# EAGLE design LightMeter (EAGLE 5.11)
PN: PRT-09545
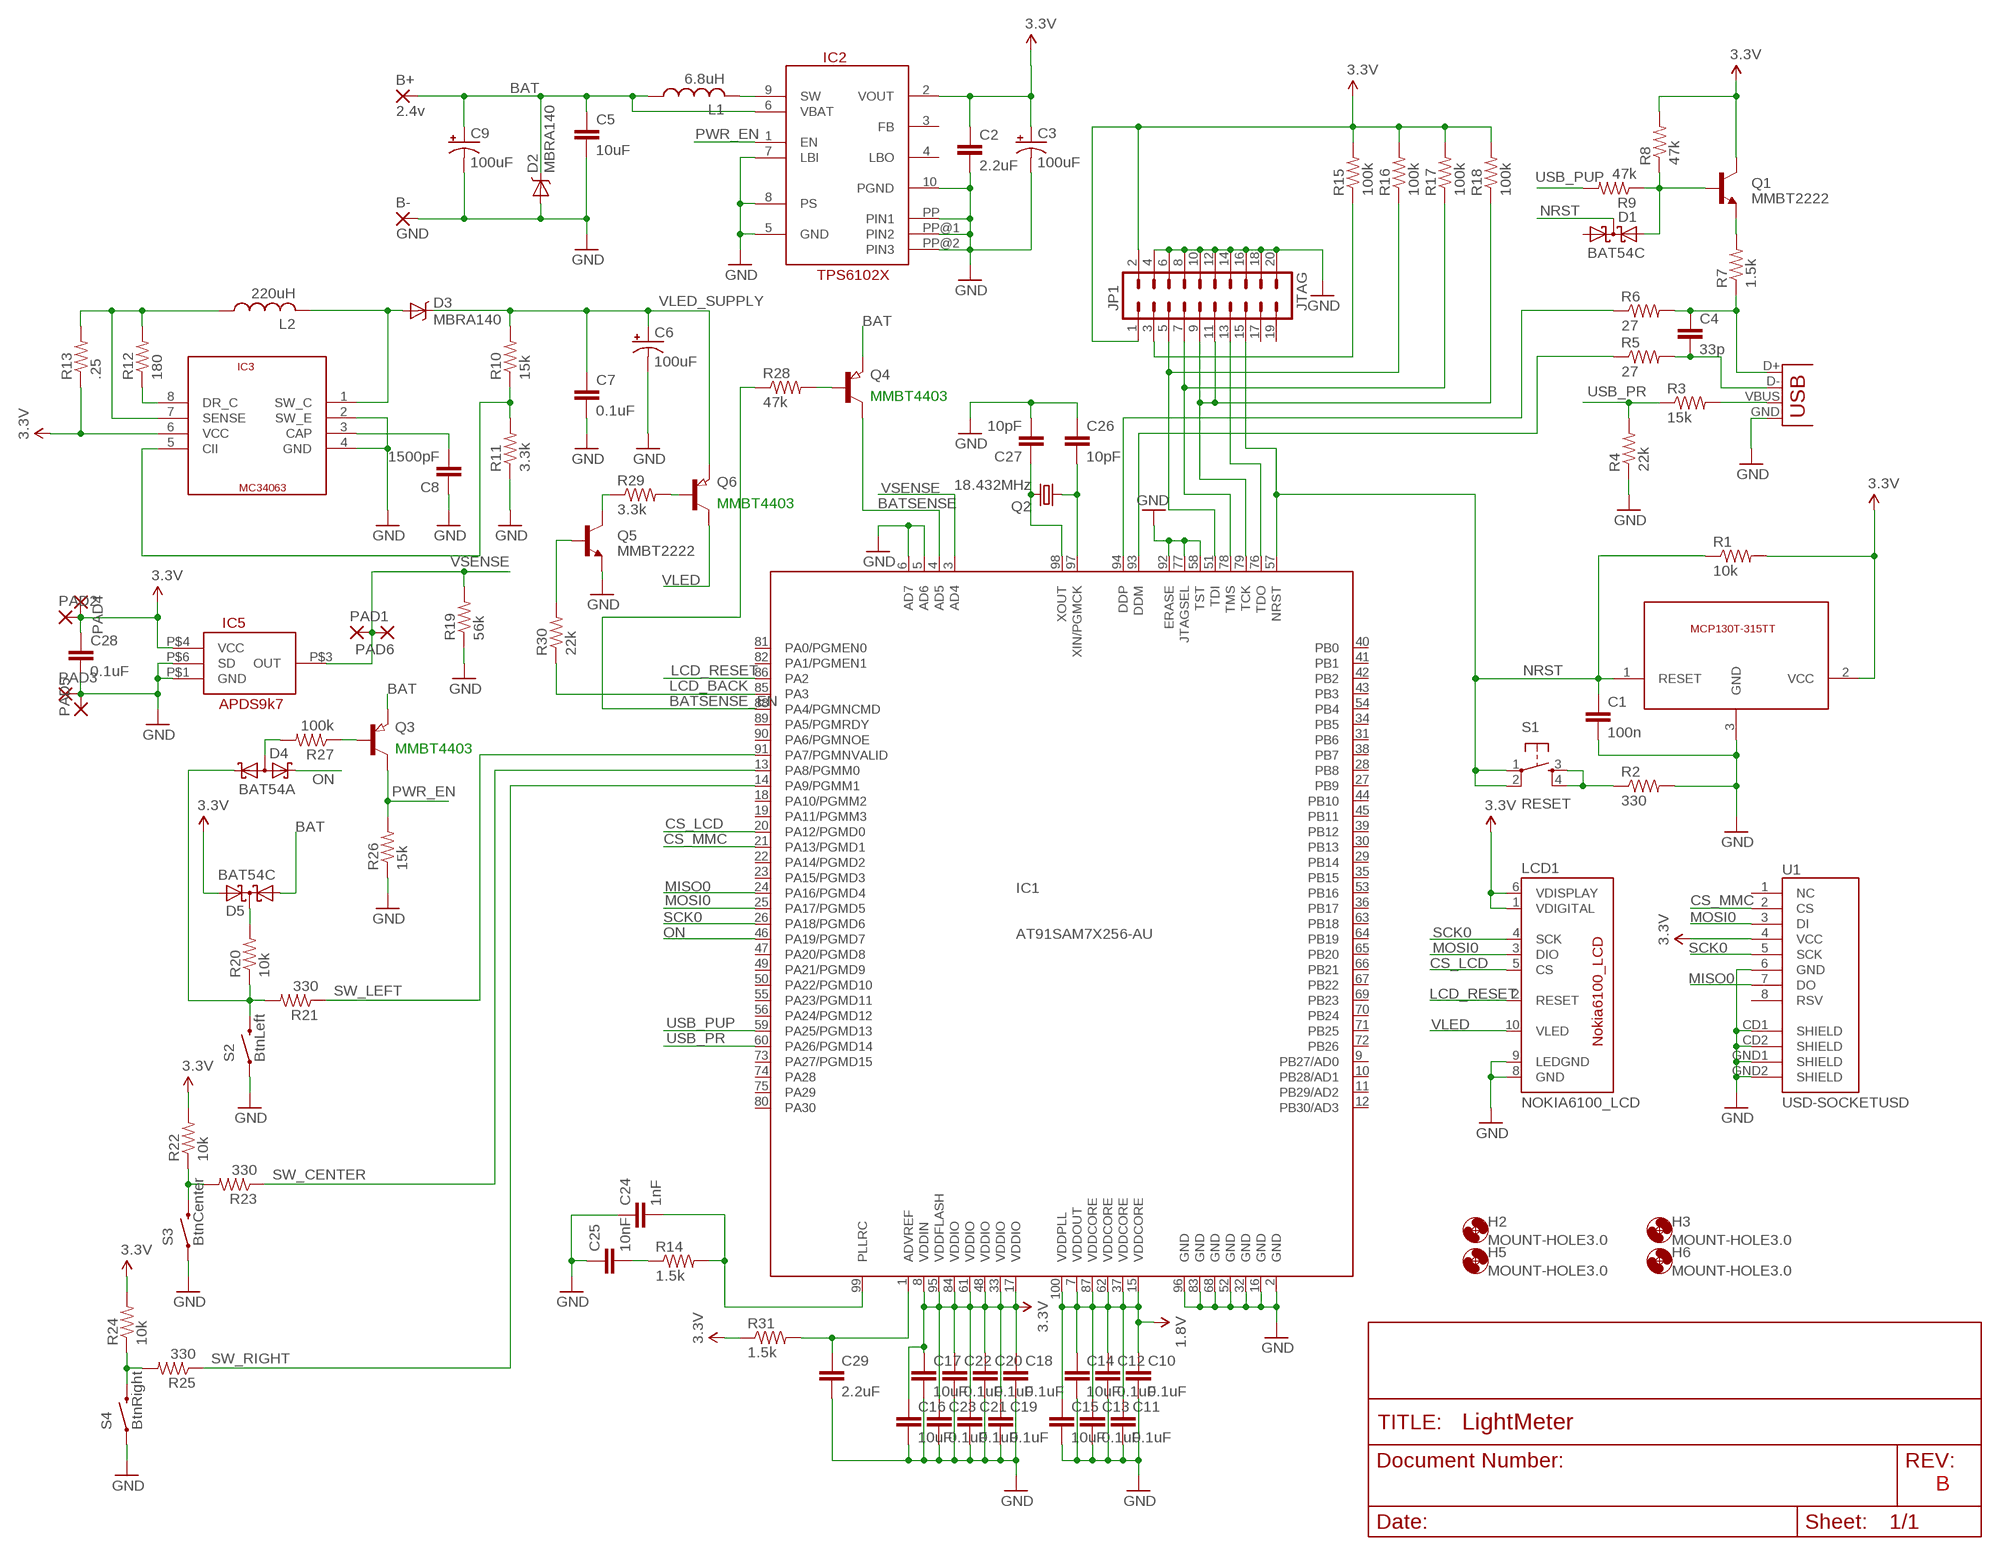
[diagram p0: schematic, sheet 1]

## Parts
B+  2.4v  2,54/1,0  [2,54/1,0]
B-  GND  2,54/1,0  [2,54/1,0]
C1  100n  CAP0805  [0805]
C2  2.2uF  CAP0805  [0805]
C3  100uF  CAP_POL7343  [EIA7343]
C4  33p  CAP0805  [0805]
C5  10uF  CAP0805  [0805]
C6  100uF  CAP_POL7343  [EIA7343]
C7  0.1uF  CAP0805  [0805]
C8  1500pF  CAP0805  [0805]
C9  100uF  CAP_POL7343  [EIA7343]
C10  0.1uF  CAP0805  [0805]
C11  0.1uF  CAP0805  [0805]
C12  0.1uF  CAP0805  [0805]
C13  0.1uF  CAP0805  [0805]
C14  10uF  CAP0805  [0805]
C15  10uF  CAP0805  [0805]
C16  10uF  CAP0805  [0805]
C17  10uF  CAP0805  [0805]
C18  0.1uF  CAP0805  [0805]
C19  0.1uF  CAP0805  [0805]
C20  0.1uF  CAP0805  [0805]
C21  0.1uF  CAP0805  [0805]
C22  0.1uF  CAP0805  [0805]
C23  0.1uF  CAP0805  [0805]
C24  1nF  CAP0805  [0805]
C25  10nF  CAP0805  [0805]
C26  10pF  CAP0805  [0805]
C27  10pF  CAP0805  [0805]
C28  0.1uF  CAP0805  [0805]
C29  2.2uF  CAP0805  [0805]
D1  BAT54C  [SOT23]
D2  MBRA140  DIODE-SCHOTTKY_  [SMA-DIODE]
D3  MBRA140  DIODE-SCHOTTKY_  [SMA-DIODE]
D4  BAT54A  [SOT23]
D5  BAT54C  [SOT23]
H2  MOUNT-HOLE3.0  [3,0]
H3  MOUNT-HOLE3.0  [3,0]
H5  MOUNT-HOLE3.0  [3,0]
H6  MOUNT-HOLE3.0  [3,0]
IC1  AT91SAM7X256-AU  [LQFP100]
IC2  TPS6102X  [S-PDSO-N10]
IC3  MC34063  [SOIC8]
IC4  MCP130  MCP130SOT-23-3  [SOT23-3]
IC5  APDS9k7  APDS-9007  [APDS-9007]
JP1  JTAG  M010X2SHD  [2X10-SHROUDED]
L1  6.8uH  INDUCTORSL4949_MM  [L4949_MM]
L2  220uH  INDUCTORSL_SLF10145  [L_SLF10145]
LCD1  NOKIA6100_LCD  [NOKIA6100_LCD]
PAD1  WIREPAD1,6/0,9  [1,6/0,9]
PAD2  WIREPAD1,6/0,9  [1,6/0,9]
PAD3  WIREPAD1,6/0,9  [1,6/0,9]
PAD4  WIREPAD1,6/0,9  [1,6/0,9]
PAD5  WIREPAD1,6/0,9  [1,6/0,9]
PAD6  WIREPAD1,6/0,9  [1,6/0,9]
Q1  MMBT2222  TRANSISTOR_NPNSOT23-3  [SOT23-3]
Q2  18.432MHz  CRYSTALSMD  [HC49UP]
Q3  MMBT4403  PNP-TRANSISTOR_SOT23  [SOT23]
Q4  MMBT4403  PNP-TRANSISTOR_SOT23  [SOT23]
Q5  MMBT2222  TRANSISTOR_NPNSOT23-3  [SOT23-3]
Q6  MMBT4403  PNP-TRANSISTOR_SOT23  [SOT23]
R1  10k  RESISTOR  [0805]
R2  330  RESISTOR  [0805]
R3  15k  RESISTOR  [0805]
R4  22k  RESISTOR  [0805]
R5  27  RESISTOR  [0805]
R6  27  RESISTOR  [0805]
R7  1.5k  RESISTOR  [0805]
R8  47k  RESISTOR  [0805]
R9  47k  RESISTOR  [0805]
R10  15k  RESISTOR  [0805]
R11  3.3k  RESISTOR  [0805]
R12  180  RESISTOR  [0805]
R13  .25  RESISTOR  [0805]
R14  1.5k  RESISTOR  [0805]
R15  100k  RESISTOR  [0805]
R16  100k  RESISTOR  [0805]
R17  100k  RESISTOR  [0805]
R18  100k  RESISTOR  [0805]
R19  56k  RESISTOR  [0805]
R20  10k  RESISTOR  [0805]
R21  330  RESISTOR  [0805]
R22  10k  RESISTOR  [0805]
R23  330  RESISTOR  [0805]
R24  10k  RESISTOR  [0805]
R25  330  RESISTOR  [0805]
R26  15k  RESISTOR  [0805]
R27  100k  RESISTOR  [0805]
R28  47k  RESISTOR  [0805]
R29  3.3k  RESISTOR  [0805]
R30  22k  RESISTOR  [0805]
R31  1.5k  RESISTOR  [0805]
S1  RESET  TAC_SWITCHSMD  [TACTILE_SWITCH_SMD]
S2  BtnLeft  SWITCH-MOMENTARY-2PTH  [TACTILE-PTH]
S3  BtnCenter  SWITCH-MOMENTARY-2PTH  [TACTILE-PTH]
S4  BtnRight  SWITCH-MOMENTARY-2PTH  [TACTILE-PTH]
U1  USD-SOCKETUSD  [USD-SOCKET-PP]
X1  USBSMD  [USB-MINIB]

## Nets
1.8V [0.85 Amp]: C10.1 C11.1 C12.1 C13.1 C14.1 C15.1 IC1.7(VDDOUT) IC1.15(VDDCORE) IC1.37(VDDCORE) IC1.62(VDDCORE) IC1.87(VDDCORE) IC1.100(VDDPLL)
3.3V [0.85 Amp]: C2.1 C3.A(+) C16.1 C17.1 C18.1 C19.1 C20.1 C21.1 C22.1 C23.1 C28.1 D5.2(A2) IC1.8(VDDIN) IC1.17(VDDIO) IC1.33(VDDIO) IC1.48(VDDIO) IC1.61(VDDIO) IC1.84(VDDIO) IC1.95(VDDFLASH) IC2.2(VOUT) IC3.6(VCC) IC4.2(VCC) IC5.P$4(VCC) JP1.1 JP1.2 LCD1.1(VDIGITAL) LCD1.6(VDISPLAY) PAD2.1(P) PAD4.1(P) Q1.3(C) R1.2 R8.2 R13.1 R15.2 R16.2 R17.2 R18.2 R22.2 R24.2 R31.1 U1.4(VCC)
BAT [1.2 Amp]: B+.1(P) C5.1 C9.A(+) D2.C D5.1(A1) IC2.6(VBAT) L1.1 Q3.2(E) Q4.2(E)
BATSENSE: IC1.4(AD5) Q4.3(C)
BATSENSE_EN: IC1.88(PA4/PGMNCMD) R28.1
CS_LCD: IC1.20(PA12/PGMD0) LCD1.5(CS)
CS_MMC: IC1.21(PA13/PGMD1) U1.2(CS)
GND [0.85 Amp]: B-.1(P) C1.2 C2.2 C3.C(-) C5.2 C6.C(-) C7.2 C8.1 C9.C(-) C10.2 C11.2 C12.2 C13.2 C14.2 C15.2 C16.2 C17.2 C18.2 C19.2 C20.2 C21.2 C22.2 C23.2 C24.1 C25.1 C26.1 C27.2 C28.2 C29.2 D2.A IC1.2(GND) IC1.5(AD6) IC1.6(AD7) IC1.16(GND) IC1.32(GND) IC1.52(GND) IC1.58(TST) IC1.68(GND) IC1.77(JTAGSEL) IC1.83(GND) IC1.92(ERASE) IC1.96(GND) IC2.5(GND) IC2.7(LBI) IC2.8(PS) IC2.10(PGND) IC2.PP(PIN1) IC2.PP@1(PIN2) IC2.PP@2(PIN3) IC3.2(SW_E) IC3.4(GND) IC4.3(GND) IC5.P$1(GND) IC5.P$6(SD) JP1.4 JP1.6 JP1.8 JP1.10 JP1.12 JP1.14 JP1.16 JP1.18 JP1.20 LCD1.8(GND) LCD1.9(LEDGND) PAD3.1(P) PAD5.1(P) Q5.2(E) R2.2 R4.1 R11.1 R19.1 R26.1 S2.1 S3.1 S4.1 U1.6(GND) U1.CD1(SHIELD) U1.CD2(SHIELD) U1.GND1(SHIELD) U1.GND2(SHIELD) X1.GND
LCD_BACK: IC1.85(PA3) R30.1
LCD_RESET: IC1.86(PA2) LCD1.2(RESET)
MISO0: IC1.24(PA16/PGMD4) U1.7(DO)
MOSI0: IC1.25(PA17/PGMD5) LCD1.3(DIO) U1.3(DI)
N$1: R3.2 X1.VBUS
N$2: C4.2 R5.2 X1.D-
N$3: C4.1 R6.2 R7.1 X1.D+
N$4: R2.1 S1.3 S1.4
N$5: IC1.93(DDM) R5.1
N$6: IC1.94(DDP) R6.1
N$7: Q1.2(E) R7.2
N$8: D1.2(A2) Q1.1(B) R8.1 R9.1
N$9 [1.2 Amp]: IC2.9(SW) L1.2
N$11: D4.1(K1) R20.1 R21.2 S2.3
N$12: IC3.5(CII) R10.1 R11.2
N$13 [1.2 Amp]: D3.A IC3.1(SW_C) L2.2
N$14 [1.2 Amp]: IC3.8(DR_C) R12.1
N$15 [1.2 Amp]: IC3.7(SENSE) L2.1 R12.2 R13.2
N$16: C26.2 IC1.97(XIN/PGMCK) Q2.1
N$17: C27.1 IC1.98(XOUT) Q2.2
N$18: C25.2 R14.1
N$19: IC1.78(TMS) JP1.7 R17.1
N$20: IC1.76(TDO) JP1.13
N$21: IC1.79(TCK) JP1.9 JP1.11 R18.1
N$22: IC1.51(TDI) JP1.5 R16.1
N$23: JP1.3 R15.1
N$24: C8.2 IC3.3(CAP)
N$25: D5.3(CC) R20.2
N$26: Q3.1(B) R27.1
N$27: D4.3(AA) R27.2
N$28: R22.1 R23.2 S3.3
N$29: C24.2 IC1.99(PLLRC) R14.2
N$30: R24.1 R25.2 S4.3
N$34: C29.1 IC1.1(ADVREF) R31.2
N$35: Q4.1(B) R28.2
N$36: Q6.1(B) R29.2
N$37: Q5.3(C) R29.1
N$38: Q5.1(B) R30.2
NRST: C1.1 D1.3(CC) IC1.57(NRST) IC4.1(RESET) JP1.15 R1.1 S1.1 S1.2
ON: D4.2(K2) IC1.46(PA19/PGMD7)
PWR_EN: IC2.1(EN) Q3.3(C) R26.2
SCK0: IC1.26(PA18/PGMD6) LCD1.4(SCK) U1.5(SCK)
SW_CENTER: IC1.13(PA8/PGMM0) R23.1
SW_LEFT: IC1.91(PA7/PGMNVALID) R21.1
SW_RIGHT: IC1.14(PA9/PGMM1) R25.1
USB_PR: IC1.60(PA26/PGMD14) R3.1 R4.2
USB_PUP: IC1.59(PA25/PGMD13) R9.2
VLED [1.2 Amp]: LCD1.10(VLED) Q6.3(C)
VLED_SUPPLY [1.2 Amp]: C6.A(+) C7.1 D3.C Q6.2(E) R10.2
VSENSE: IC1.3(AD4) IC5.P$3(OUT) PAD1.1(P) PAD6.1(P) R19.2
Unconnected: D1.1(A1) IC1.9(PB27/AD0) IC1.10(PB28/AD1) IC1.11(PB29/AD2) IC1.12(PB30/AD3) IC1.18(PA10/PGMM2) IC1.19(PA11/PGMM3) IC1.22(PA14/PGMD2) IC1.23(PA15/PGMD3) IC1.27(PB9) IC1.28(PB8) IC1.29(PB14) IC1.30(PB13) IC1.31(PB6) IC1.34(PB5) IC1.35(PB15) IC1.36(PB17) IC1.38(PB7) IC1.39(PB12) IC1.40(PB0) IC1.41(PB1) IC1.42(PB2) IC1.43(PB3) IC1.44(PB10) IC1.45(PB11) IC1.47(PA20/PGMD8) IC1.49(PA21/PGMD9) IC1.50(PA22/PGMD10) IC1.53(PB16) IC1.54(PB4) IC1.55(PA23/PGMD11) IC1.56(PA24/PGMD12) IC1.63(PB18) IC1.64(PB19) IC1.65(PB20) IC1.66(PB21) IC1.67(PB22) IC1.69(PB23) IC1.70(PB24) IC1.71(PB25) IC1.72(PB26) IC1.73(PA27/PGMD15) IC1.74(PA28) IC1.75(PA29) IC1.80(PA30) IC1.81(PA0/PGMEN0) IC1.82(PA1/PGMEN1) IC1.89(PA5/PGMRDY) IC1.90(PA6/PGMNOE) IC2.3(FB) IC2.4(LBO) JP1.17 JP1.19 U1.1(NC) U1.8(RSV)

## Notes on the sheet
- B

## Library data of the parts
B+ B- = wirepad:2,54/1,0: THROUGH-HOLE PAD
C1 C2 C4 C5 C7 C8 C10-C29 = SparkFun:CAP: Capacitor Standard 0603 ceramic capacitor, and 0.1" leaded capacitor.
C3 C6 C9 = SparkFun:CAP_POL: Capacitor Polarized These are standard SMD and PTH capacitors. Normally 10uF, 47uF, and 100uF in electrolytic and tantalum varieties. Always verify the external diameter of the through hole cap, it varies with capacity, voltage, and manufacturer. The EIA devices should be standard.
D1 D5 = diode:BAT54C: Schottky Diodes Source: Fairchild .. BAT54.pdf
D2 D3 = SparkFun:DIODE-SCHOTTKY
D4 = diode:BAT54A: Schottky Diodes Source: Fairchild .. BAT54.pdf
H2 H3 H5 H6 = holes:MOUNT-HOLE: MOUNTING HOLE with drill center marker
IC1 = johnz:AT91SAM7X*-AU: Highly integrated Flash microcontrollers based on the 32-bit ARM RISC processor 512/256/128 Kbyte high-speed Flash and 128/64/32 Kbyte SRAM, a large set of peripherals, including an 802.3 Ethernet MAC and a CAN controller Source: http://www.atmel.com/dyn/resources/prod_documents/6120s.pdf
IC2 = johnz:TPS6102X
IC3 = johnz:MC34063
IC4 = johnz:MCP130
IC5 = johnz:APDS-9007
JP1 = johnz:M010X2: Header 10x2 Standard 20-pin dual row 0.1" header. Used as the JTAG connector on Olimex boards.
L1 L2 = johnz:INDUCTORS: INDUCTOR, American symbol
LCD1 = johnz:NOKIA6100_LCD: Nokia 6100 Color LCD Schematic element and footprint production proven but could use some touching up. Spark Fun Electronics SKU : LCD-00569. Mating SMD connector : LCD-00570
PAD1-PAD6 = wirepad:WIREPAD: Wire PAD connect wire on PCB
Q1 Q5 = SparkFun:TRANSISTOR_NPN: Transistor NPN BJT configuration in SOT23 package. MMBT2222 is the common NPN we use. Double check BCE configuration again layout.
Q2 = SparkFun:CRYSTAL: Crystals Various standard crystals. Proven footprints. Spark Fun Electronics SKU : COM-00534
Q3 Q4 Q6 = semicon-smd-ipc:PNP-TRANSISTOR_: PNP TRANSISTOR
R1-R31 = SparkFun:RESISTOR: Resistor Basic schematic elements and footprints for 0603, 1206, and PTH 1/10th watt (small) resistors.
S1 = SparkFun:TAC_SWITCH: Momentary Switch Button commonly used for reset or general input. Spark Fun Electronics SKU : COM-00097
S2-S4 = SparkFun:SWITCH-MOMENTARY-2
U1 = SparkFun:USD-SOCKET: microSD Socket Push-push type uSD socket. Schematic element and footprint production proven. Spark Fun Electronics SKU : PRT-00127. tDoc lines correctly indicate media card edge positions when inserting (unlocked, locked, depressed).
X1 = SparkFun:USB: USB Connectors USB-B-PTH is fully proven SKU : PRT-00139 USB-miniB is fully proven SKU : PRT-00587 USB-A-PCB is untested. USB-A-H is throughly reviewed, but untested. Spark Fun Electronics SKU : PRT-00437 USB-B-SMT is throughly reviewed, but untested. Needs silkscreen touching up. USB-A-S has not been used/tested USB-MB-H has not been used/tested

## Net classes
0 default: width 0.203 mm
1 0.85 Amp: width 0.254 mm
2 1.2 Amp: width 0.406 mm

## Board
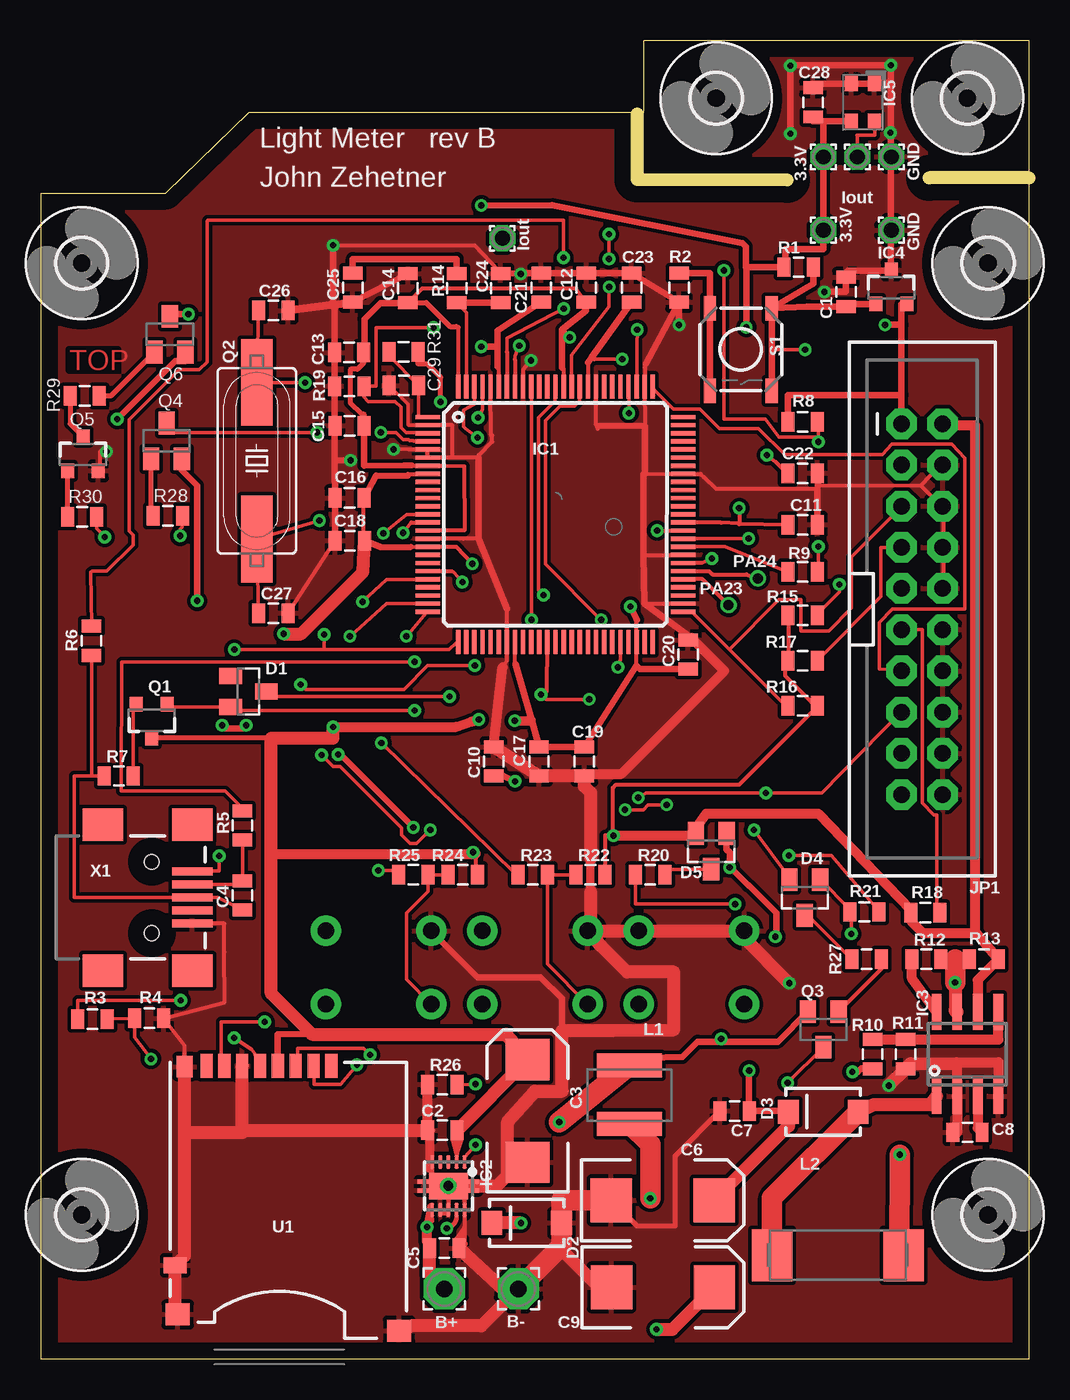
[diagram p1: board, top side]
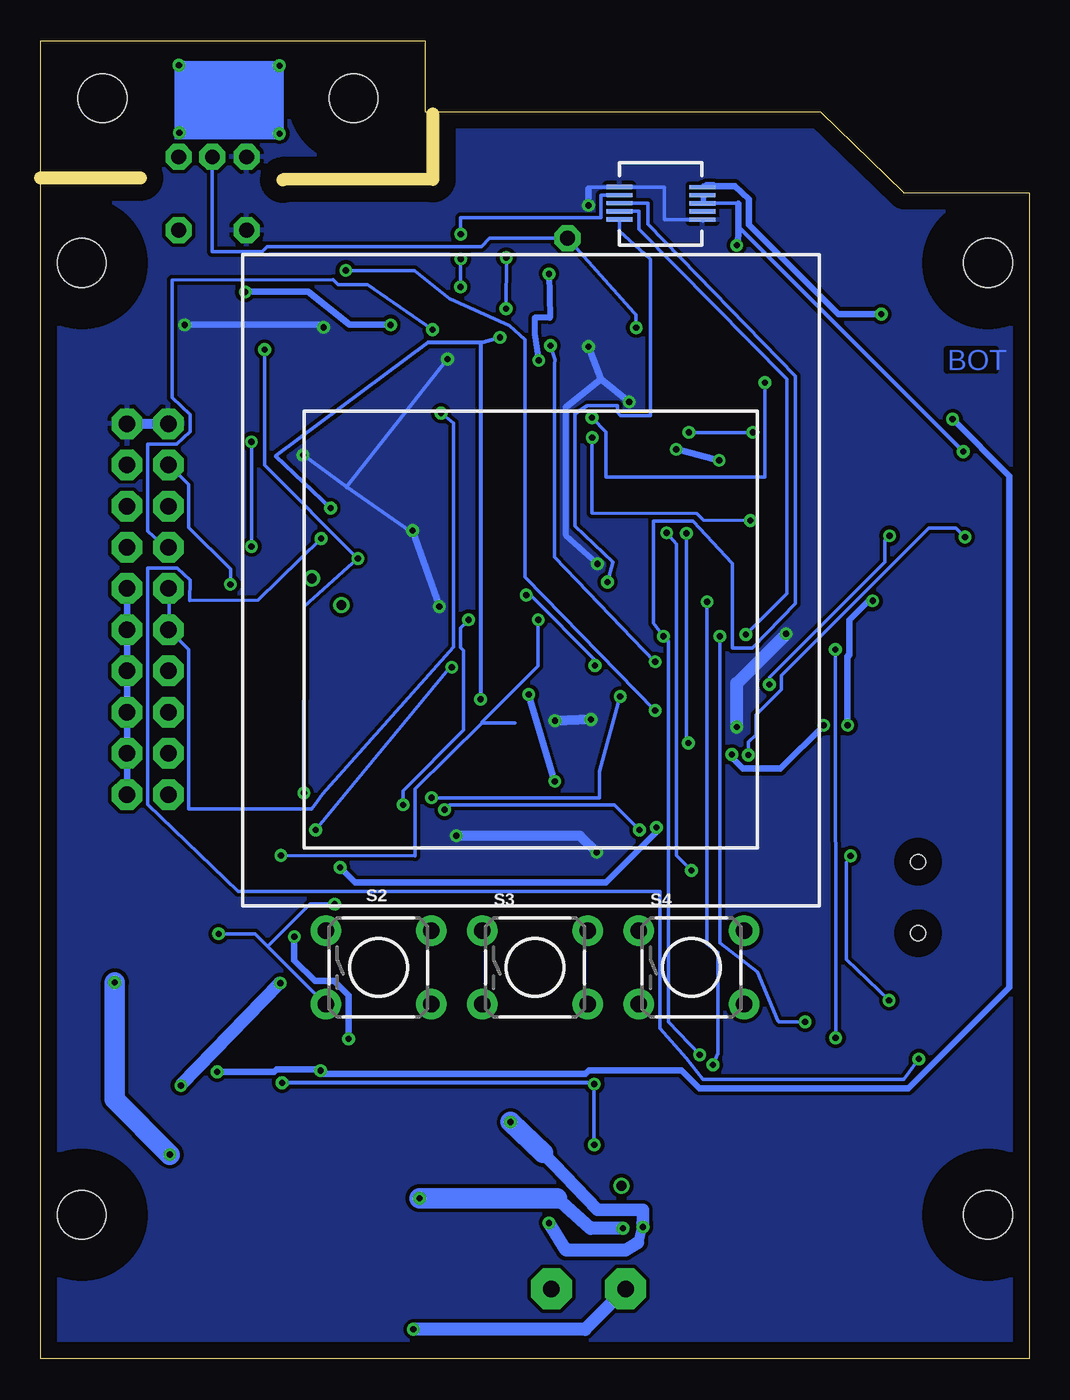
[diagram p2: board, bottom side, seen from below]

Size 60.96 x 81.28 mm. Coordinates in mm from the lower left corner, seen from the top.
Outline: 60.96,72.82 60.96,0 0,0 0,71.88 7.72,71.88 7.75,71.91 12.85,76.86 37.21,76.86 37.21,81.28 60.96,81.28 60.96,72.82
Outline: 60.96,72.82 54.79,72.82
Outline: 36.78,76.76 36.78,72.72 46.02,72.69
Copper layers (1*16): Top 0.035mm / dielectric 1.5mm / Bottom 0.035mm
Design rules "default *": minimum track width 0.2007mm, minimum drill 15mil, track to track 0.2261mm, track to pad 0.2261mm, pad to pad 0.2261mm, via to via 0.2261mm, smd to smd 0.2261mm, copper to edge 40mil, drill to drill 8mil, minimum pad ring 10mil, minimum via ring 8mil, stop-mask expansion 4mil, vias tented up to drill 0mil, thermal gap 10mil

### Footprints (pad centres in the part's own frame; a part is rotated, then mirrored left to right if it is on the bottom)
2,54/1,0 = drill 1.016 pad 2.54 octagon: 1 0,0
0805 = smd 0.8 x 1.2: 1 -0.9,0; 2 0.9,0
EIA7343 = smd 2.55 x 2.7: A 3.17,0; C -3.17,0
SOT23 = smd 1 x 1.4: 1 -0.95,-1.1; 2 0.95,-1.1; 3 0,1.1
SMA-DIODE = smd 1.27 x 1.47: A -2.15,0; C 2.15,0
3,0 = hole 3: 0,0
LQFP100 = smd 1.5 x 0.265: 1 -7.875,6; 2 -7.875,5.5; 3 -7.875,5; 4 -7.875,4.5; 5 -7.875,4; 6 -7.875,3.5; 7 -7.875,3; 8 -7.875,2.5; 9 -7.875,2; 10 -7.875,1.5; 11 -7.875,1; 12 -7.875,0.5; 13 -7.875,0; 14 -7.875,-0.5; 15 -7.875,-1; 16 -7.875,-1.5; 17 -7.875,-2; 18 -7.875,-2.5; 19 -7.875,-3; 20 -7.875,-3.5; 21 -7.875,-4; 22 -7.875,-4.5; 23 -7.875,-5; 24 -7.875,-5.5; 25 -7.875,-6; 51 7.875,-6; 52 7.875,-5.5; 53 7.875,-5; 54 7.875,-4.5; 55 7.875,-4; 56 7.875,-3.5; 57 7.875,-3; 58 7.875,-2.5; 59 7.875,-2; 60 7.875,-1.5; 61 7.875,-1; 62 7.875,-0.5; 63 7.875,0; 64 7.875,0.5; 65 7.875,1; 66 7.875,1.5; 67 7.875,2; 68 7.875,2.5; 69 7.875,3; 70 7.875,3.5; 71 7.875,4; 72 7.875,4.5; 73 7.875,5; 74 7.875,5.5; 75 7.875,6 | smd 0.265 x 1.5: 26 -6,-7.875; 27 -5.5,-7.875; 28 -5,-7.875; 29 -4.5,-7.875; 30 -4,-7.875; 31 -3.5,-7.875; 32 -3,-7.875; 33 -2.5,-7.875; 34 -2,-7.875; 35 -1.5,-7.875; 36 -1,-7.875; 37 -0.5,-7.875; 38 0,-7.875; 39 0.5,-7.875; 40 1,-7.875; 41 1.5,-7.875; 42 2,-7.875; 43 2.5,-7.875; 44 3,-7.875; 45 3.5,-7.875; 46 4,-7.875; 47 4.5,-7.875; 48 5,-7.875; 49 5.5,-7.875; 50 6,-7.875; 76 6,7.875; 77 5.5,7.875; 78 5,7.875; 79 4.5,7.875; 80 4,7.875; 81 3.5,7.875; 82 3,7.875; 83 2.5,7.875; 84 2,7.875; 85 1.5,7.875; 86 1,7.875; 87 0.5,7.875; 88 0,7.875; 89 -0.5,7.875; 90 -1,7.875; 91 -1.5,7.875; 92 -2,7.875; 93 -2.5,7.875; 94 -3,7.875; 95 -3.5,7.875; 96 -4,7.875; 97 -4.5,7.875; 98 -5,7.875; 99 -5.5,7.875; 100 -6,7.875
S-PDSO-N10 = smd 0.27 x 0.85: 1 -1,-1.475; 2 -0.5,-1.475; 3 0,-1.475; 4 0.5,-1.475; 5 1,-1.475; 6 1,1.475; 7 0.5,1.475; 8 0,1.475; 9 -0.5,1.475; 10 -1,1.475 | smd 2.4 x 1.63: PP 0,0 | smd 3.8 x 0.28: PP@1 0,0.275; PP@2 0,-0.275
SOIC8 = smd 0.6 x 2.2: 1 -1.905,-2.6; 2 -0.635,-2.6; 3 0.635,-2.6; 4 1.905,-2.6; 5 1.905,2.6; 6 0.635,2.6; 7 -0.635,2.6; 8 -1.905,2.6
SOT23-3 = smd 0.8 x 0.9: 1 -0.95,-1; 2 0.95,-1; 3 0,1.1
APDS-9007 = smd 0.9 x 0.8: P$1 -1.15,0.7; P$3 1.15,0.7; P$4 1.15,-0.7; P$6 -1.15,-0.7
2X10-SHROUDED = drill 1.016 pad 1.88 octagon: 1 -1.27,11.43; 2 1.27,11.43; 3 -1.27,8.89; 4 1.27,8.89; 5 -1.27,6.35; 6 1.27,6.35; 7 -1.27,3.81; 8 1.27,3.81; 9 -1.27,1.27; 10 1.27,1.27; 11 -1.27,-1.27; 12 1.27,-1.27; 13 -1.27,-3.81; 14 1.27,-3.81; 15 -1.27,-6.35; 16 1.27,-6.35; 17 -1.27,-8.89; 18 1.27,-8.89; 19 -1.27,-11.43; 20 1.27,-11.43
L4949_MM = smd 1.5 x 4: 1 -2.35,0; 2 1.25,0
L_SLF10145 = smd 2.5 x 3.2: 1 -4.05,0; 2 4.05,0
NOKIA6100_LCD = smd 1.6 x 0.26: 1 24.255,44.311; 2 24.255,43.811; 3 24.255,43.311; 4 24.255,42.811; 5 24.255,42.311; 6 29.389,42.303; 7 29.389,42.803; 8 29.389,43.303; 9 29.389,43.803; 10 29.389,44.303
1,6/0,9 = drill 0.914 pad 1.6 octagon: 1 0,0
HC49UP = smd 5.334 x 1.93: 1 -4.826,0; 2 4.826,0
TACTILE_SWITCH_SMD = smd 1.524 x 0.762: 1 -2.54,1.905; 2 2.54,1.905; 3 -2.54,-1.905; 4 2.54,-1.905
TACTILE-PTH = drill 1.016 pad 1.88 round: 1 -3.251,2.261; 2 3.251,2.261; 3 -3.251,-2.261; 4 3.251,-2.261
USD-SOCKET-PP = smd 0.75 x 1.5: 1 3.2,16.8; 2 2.1,16.8; 3 1,16.8; 4 -0.1,16.8; 5 -1.2,16.8; 6 -2.3,16.8; 7 -3.4,16.8; 8 -4.5,16.8 | smd 1 x 1.3: CD1 -5.85,16.75 | smd 1.4 x 1: CD2 -6.425,4.5 | smd 1.5 x 1.35: GND1 -6.275,1.475; GND2 7.375,0.475
USB-MINIB = smd 2.5 x 0.5: D+ 2.5,0; D- 2.5,0.8; GND 2.5,-1.6; ID 2.5,-0.8; VBUS 2.5,1.6 | smd 2.5 x 2: GND@1 -3,-4.5; GND@2 -3,4.5; GND@3 2.5,4.5; GND@4 2.5,-4.5 | hole 0.9: 0,2.2; 0,-2.2

### Placement (x,y rotation side)
B+  24.89,4.32 0 top
B-  29.46,4.32 0 top
C1  49.66,65.79 90 top
C2  24.77,14.1 180 top
C3  30.02,15.29 90 top
C4  12.45,28.57 90 top
C5  24.89,6.83 0 top
C6  38.35,9.78 0 top
C7  42.8,15.29 180 top
C8  57.15,13.97 0 top
C9  38.38,4.42 0 top
C10  27.94,36.83 90 top
C11  46.99,51.44 0 top
C12  33.66,66.04 90 top
C13  19.02,62.05 180 top
C14  22.66,66.01 90 top
C15  19.05,57.53 180 top
C16  19.05,53.09 180 top
C17  30.73,36.83 270 top
C18  19.08,50.44 180 top
C19  33.53,36.83 270 top
C20  39.93,43.43 90 top
C21  30.86,66.04 90 top
C22  46.99,54.61 0 top
C23  36.45,66.04 90 top
C24  28.37,66.01 270 top
C25  19.25,66.04 90 top
C26  14.35,64.64 180 top
C27  14.35,45.97 0 top
C28  47.62,77.47 90 top
C29  22.4,60.02 180 top
D1  12.83,41.15 270 top
D2  29.97,8.38 180 top
D3  48.26,15.24 180 top
D4  47.12,28.45 180 top
D5  41.35,31.29 180 top
H1  MOUNT-HOLE3.0  [3,0]  58.42,67.56 0 top
H2  58.42,8.89 0 top
H3  2.54,8.89 0 top
H4  MOUNT-HOLE3.0  [3,0]  2.54,67.56 0 top
H5  57.15,77.72 0 top
H6  41.66,77.72 0 top
IC1  31.75,52.07 0 top
IC2  25.15,10.67 180 top
IC3  57.15,18.8 0 top
IC4  52.45,66.04 0 top
IC5  50.7,77.47 270 top
JP1  54.36,46.23 0 top
L1  36.32,15.75 270 top
L2  49.15,6.4 180 top
LCD1  49.53,27.94 0 bottom
PAD1  50.37,74.11 0 top
PAD2  48.26,74.11 0 top
PAD3  52.45,74.11 0 top
PAD4  48.26,69.6 0 top
PAD5  52.45,69.6 0 top
PAD6  28.47,69.09 0 top
Q1  6.86,39.37 180 top
Q2  13.34,55.37 270 top
Q3  48.26,20.32 180 top
Q4  7.77,56.59 0 top
Q5  2.62,55.75 0 top
Q6  7.98,63.17 0 top
R1  46.74,67.31 180 top
R2  39.37,66.04 270 top
R3  3.2,20.95 180 top
R4  6.71,21.01 180 top
R5  12.45,32.89 270 top
R6  3.15,44.27 270 top
R7  4.83,35.94 0 top
R8  46.99,57.79 180 top
R9  46.99,48.51 180 top
R10  51.31,18.8 270 top
R11  53.34,18.8 90 top
R12  54.61,24.64 0 top
R13  58.17,24.64 180 top
R14  25.65,66.01 270 top
R15  46.99,45.85 180 top
R16  46.99,40.26 0 top
R17  46.99,43.05 180 top
R18  54.56,27.51 180 top
R19  19.04,59.97 0 top
R20  37.59,29.84 0 top
R21  50.8,27.56 180 top
R22  33.91,29.84 0 top
R23  30.35,29.84 0 top
R24  26.04,29.84 0 top
R25  22.99,29.84 0 top
R26  24.77,16.92 0 top
R27  50.93,24.64 180 top
R28  7.85,51.99 180 top
R29  2.72,59.39 0 top
R30  2.57,51.92 180 top
R31  22.38,62.08 180 top
S1  43.18,62.23 270 top
S2  40.13,24.13 0 bottom
S3  30.48,24.13 0 bottom
S4  20.83,24.13 0 bottom
U1  14.73,1.27 0 top
X1  6.86,28.45 0 top

### Tracks (layer width: path | path; a pad name or v marks a point on that pad's centre or on a via)
1.8V  (via drill 0.38)
  Top 0.254: 22.88,55.09 22.9,55.07 IC1.7 24.96,55.07 26.11,55.05 26.14,51.08 IC1.15 | 32.16,61.11 32.25,61.04 32.25,60.63 IC1.87 | 43.08,51.5 41.96,51.56 39.63,51.56 IC1.62 | 43.08,51.5 C11.1 | IC1.37 31.22,41.16 30.82,40.98 31.17,40.69 v33.83,40.67 | C12.1 33.53,65.28 33.02,65.99 23.53,65.99 C14.1 | v43.08,52.45 43.08,51.46 43.08,51.5 | v32.63,62.98 32.26,63.45 32.16,63.45 | 25.75,63.61 IC1.100
  Top 0.305: C13.1 19.91,61.87 19.91,61.39 19.53,61.01 19.13,61.01 19.1,60.99 19.1,58.95 19.79,58.27 19.91,58.27 19.94,58.24 19.94,57.71 C15.1 | C14.1 22.86,65.13 23.77,65.13 25.25,63.65 25.63,63.65 25.75,63.61
  Top 0.356: 19.96,55.08 22.4,55.09 22.88,55.09
  Top 0.406: C15.1 19.96,55.08 | 32.16,61.11 32.16,63.45 33.63,64.62 C12.1 | C10.1 28.55,35.93 v29.26,35.61 | v30.86,40.97 30.82,40.98 | C14.1 20.95,65.1 19.96,64.11 19.96,62.09 C13.1
  Bottom 0.203: v33.83,40.67 33.81,40.69
  Bottom 0.254: v43.08,52.45 46.46,55.65 37.05,62.66 33.8,62.66 | 33.81,40.69 33.8,62.66 | 33.8,62.66 v32.63,62.98
  Bottom 0.406: v29.26,35.61 v30.86,40.97
3.3V  (via drill 0.38)
  Top 0.203: IC1.8 23.85,54.56 23.5,54.56 23.38,54.57
  Top 0.254: R22.2 34.81,32.29 35.28,32.29 | R15.2 46.13,45.77 46.13,43.13 R17.2 45.92,42.93 45.92,42.11 47.75,40.28 R16.2 47.75,40.08 43.08,35.41 35.48,35.41 35.28,35.2 35.28,32.29 | 53.65,27.69 R18.2 | PAD4.1 48.36,69.55 48.27,69.55 | 48.26,74 48.36,74.02 PAD2.1 | R24.2 26.82,29.92 26.82,31.14 26.77,31.14 v26.67,31.24 | U1.4 14.63,18.14 | 57.67,26.26 57.63,26.47 | 55.68,57.56 JP1.2 | 25.65,14.1 IC2.2 | 29.26,42.84 IC1.33 | 28.16,61.16 28.25,61.16 28.26,60.02 IC1.95 | IC1.84 33.76,61.42 | 22.83,50.07 IC1.17 24,50.07 25.62,50.07 v26.62,49.02 | 36.75,42.76 IC1.48 36.75,45.62 | v38.02,51.07 IC1.61 | v44.78,55.73 45.31,55.32 45.92,54.71 C22.1 | v35.87,61.65 34.14,61.62 33.98,61.73 | 30.73,37.8 30.89,37.85 C17.1 | 22.66,54.46 22.63,54.48 22.63,54.56 23.37,54.56 23.38,54.57 | C16.1 19.91,52.88 19.91,50.85 C18.1 | v35.33,32.26 35.36,32.36 35.28,32.29 | 30.2,39.65 30.28,39.68 30.23,39.37
  Top 0.305: 29.29,42.85 29.26,42.84 | 14.22,38.27 Q1.3 | v24.66,59 24.66,60.53 23.85,61.34 23.29,61.34 23.27,61.37 23.27,62.08 R31.1
  Top 0.356: 20.95,50.06 22.83,50.07 | 20.7,54.45 22.66,54.46
  Top 0.406: C28.1 47.62,76.32 IC5.P$4 48.27,76.3 48.26,75.44 48.26,74 48.27,69.55 48.27,68.43 45.92,68.43 45.92,67.31 R1.2 43.48,67.31 | IC4.2 53.09,65.04 53.09,63.75 | 53.09,59.44 53.09,63.75 | JP1.1 53.09,59.44 | 53.09,63.75 v52.07,63.75 | v43.51,63.6 43.51,67.33 43.48,67.31 | R8.2 46.09,59.44 53.09,59.44 | v27.18,71.11 31.55,71.12 43.28,68.78 43.48,68.58 43.48,67.31 | R18.2 53.66,27.01 | 40.4,32.29 D5.2 | D5.2 40.4,32.77 | D5.2 40.44,32.77 | C2.1 25.65,14.1 | 30.23,18.29 29.86,18.29 | C17.1 C19.1 36.75,42.76 36.97,42.53 C20.1 | 30.75,37.73 30.73,37.8 30.2,39.65 29.29,42.85 | 28.16,62.41 28.16,61.16 | C21.1 28.16,63.4 28.16,62.41 | 33.76,61.42 33.98,61.73 C23.1 | C18.1 20.95,50.06 | 36.75,45.62 36.78,45.57 v36.37,46.38 | v27.17,62.41 28.16,62.41 | C16.1 20.7,54.45 | 16.71,20.04 14.63,20.02 U1.4
  Top 0.61: IC3.6 57.78,23.36 R13.1 57.67,26.26 54.41,26.26 53.66,27.01 | 35.28,32.29 40.4,32.29 | 53.65,27.69 47.95,33.63 41.05,33.63 40.44,32.77 | 14.22,31.14 26.82,31.14 | 57.63,26.47 57.63,57.56 55.68,57.56 | 29.86,18.29 C2.1 | v18.03,38.96 25.63,38.96 26.57,39.29 v27.03,39.42 | v29.23,39.35 30.23,39.37
  Top 0.813: C2.1 C3.A | 30.23,18.29 28.7,20.02 16.74,20.02 16.71,20.04 14.22,22.53 14.22,31.14 14.22,38.27 18.03,38.27 v18.03,38.96 | v14.99,44.7 16.05,44.7 19.87,48.53 C18.1
  Bottom 0.203: 20.12,70.16 20.12,70.24 LCD1.6 22.48,70.23 22.48,72.25 LCD1.1 27.13,72.25 27.18,72.14
  Bottom 0.254: 42.09,53.75 38.2,51.05 v38.02,51.07 | 42.09,53.75 v44.78,55.73 | 42.09,53.75 v35.87,61.65
  Bottom 0.356: v26.62,49.02 28.55,50.75 28.55,58.67
  Bottom 0.406: v43.51,63.6 43.79,63.75 v52.07,63.75 | v27.18,71.11 27.18,72.14 | v36.37,46.38 v38.02,51.07 | 26.42,60.4 v27.17,62.41 | 26.42,60.4 v24.66,59 | 28.55,58.67 26.42,60.4
  Bottom 0.61: JP1.2 JP1.1 | v26.67,31.24 27.69,32.26 v35.33,32.26 | v27.03,39.42 v29.23,39.35
  Bottom 0.813: v14.99,44.7 18.03,41.66 v18.03,38.96
  pour Bottom: 0.38,0.43 0.38,71.45 8.1,71.45 12.95,76.3 37.82,76.3 37.82,80.9 60.81,80.9 60.81,0.51
BAT  (via drill 0.38)
  Top 0.254: 24.15,8.63 IC2.6
  Top 0.279: v23.82,8.13 24.08,8.52 24.15,8.63
  Top 0.406: Q3.2 45.45,19.56 41.96,19.56 | 41.96,19.56 40.51,19.56 39.57,18.62 36.32,18.54 L1.1 | C5.1 23.82,7.28 | 23.88,8.61 23.77,8.13 | 23.88,8.61 24.05,9.4 | 23.88,8.61 23.98,8.59 24.08,8.52 | v22.99,32.77 18.49,37.26 v18.34,37.26 | v12.68,39.07 12.47,38.86 11.4,38.86 v11.2,39.07 | v9.65,46.74 9.65,53.85 8.71,54.79 8.71,55.47 Q4.2 | D5.1 42.29,31.42 42.49,31.22 v42.49,30.3 42.65,30.18 43.64,29.18 43.66,29.18 45.36,27.48 45.36,26.09 v45.31,26.04 | 41.96,19.56 v41.96,19.74
  Top 0.61: 23.82,7.28 v23.82,8.13
  Top 0.813: v29.62,8.38 D2.C | B+.1 23.99,5.22 C5.1 | C9.A 38.96,1.83 v37.97,1.83
  Top 1.27: L1.1 31.95,14.58 v31.98,14.61
  Bottom 0.406: v42.49,30.3 41.55,29.36 26.11,29.36 22.99,32.49 v22.99,32.77 | v18.34,37.26 18.34,37.08 17.65,36.4 15.34,36.4 v12.68,39.07 | v11.2,39.07 11.2,43.31 11.1,43.41 11.1,45.57 9.93,46.74 v9.65,46.74 | v45.31,26.04 45.31,24.56 44.04,23.29 42.85,23.29 41.96,22.4 v41.96,19.74
  Bottom 0.61: 23.82,8.38 24.13,7.16
  Bottom 0.762: 29.97,12.7 26.62,9.2 23.82,9.2 23.82,8.38
  Bottom 0.813: v23.82,8.13 23.82,8.38 | 24.13,7.16 24.89,6.71 28.55,6.71 v29.62,8.38 | v37.97,1.83 27.38,1.83 B+.1
  Bottom 1.27: 29.97,12.7 v31.98,14.61
BATSENSE  (via drill 0.38)
  Top 0.203: v20.98,57.12 21.92,57.12 22.35,56.69 22.68,56.69 22.76,56.62 22.96,56.62 22.99,56.59 23.32,56.59 23.34,56.57 23.85,56.57 IC1.4 | v17.04,57.12 7.8,57.12 7.77,57.15 Q4.3
  Bottom 0.203: v17.04,57.12 v20.98,57.12
BATSENSE_EN  (via drill 0.38)
  Top 0.203: v31.01,47.09 30.71,47.4 30.71,58.04 31.73,59.05 31.73,59.31 31.75,59.33 IC1.88 | v26.77,42.75 23.88,42.75 22.4,41.28 16.33,41.28 v16.03,41.58 | v8.61,50.75 8.61,51.16 8.74,51.28 8.74,51.99 R28.1
  Bottom 0.203: v31.01,47.09 30.76,47.09 26.77,43.1 v26.77,42.75 | v16.03,41.58 16.03,42.01 8.91,49.12 8.91,50.44 v8.61,50.75
CS_LCD  (via drill 0.38)
  Top 0.203: 25.35,48.57 25.45,48.51 v26.01,47.9 | IC1.20 23.98,48.57
  Top 0.254: 23.98,48.57 25.35,48.57
  Bottom 0.203: v26.01,47.9 25.65,49.12 28.02,51.36 28.02,58.27 27.23,58.78 25.4,58.78 25.4,58.37 25.2,58.17 23.37,58.17 23.37,67.82 25.3,69.55 25.27,69.55 LCD1.5
CS_MMC  (via drill 0.38)
  Top 0.203: v19.51,18.14 18.49,16.92 16.87,16.92 16.87,17.93 U1.2 | v19.86,46.69 21.34,48.06 23.77,48.06 IC1.21
  Bottom 0.203: v19.51,18.14 19.2,18.85 19.2,25.07 19.87,25.58 v19.86,46.69
GND  (via drill 0.38, 0.6 pad 0.25)
  Top 0.203: 47.91,53.85 54.28,53.85 | IC2.8 IC2.7 | 21.5,60.34 C29.2 22.66,58.87 22.66,57.61 22.69,57.57 IC1.2 | 18.22,55.39 18.15,55.46 C15.2
  Top 0.254: 28.5,42.65 28.75,43.04 | 28.75,43.04 28.75,43.5 | IC1.96 27.75,59.91 27.79,56.94 | 27.79,56.94 27.79,56.92 | 37.29,61.39 37.25,61.39 37.33,61.37 37.26,61.3 37.26,61.14 IC1.77 37.26,57.51 | IC1.16 26.06,50.57 27,50.57 | 25.91,55.57 27.01,55.57 27.03,55.73 27.84,56.54 27.84,56.95 27.79,56.94 | IC1.2 25.4,57.56 25.4,55.57 25.91,55.57 | 37.24,46.56 IC1.52 | 37.19,49.55 IC1.58 | 37.19,54.56 IC1.68 39.83,54.56 40.69,54.56 40.89,54.36 41.66,53.65 47.89,53.65 47.95,53.7 | IC1.83 34.25,57.59 34.34,57.51 34.34,57.35 | C18.2 C27.2 | 28.75,43.04 IC1.32 28.75,46.23 | X1.GND 11.32,26.85 11.32,25.09 11.34,22 R4.1 8.88,19.32 U1.CD1 | 26.15,8.13 IC2.10 26.15,10.67 | 26.15,8.13 26.15,7.11 | 24.15,14.1 IC2.5 24.15,10.94 | IC2.PP@1 IC2.8 | 55.68,50.04 55.68,52.48 JP1.6 55.47,52.68 54.28,53.85 55.47,55.12 JP1.4 | 55.68,50.04 55.68,47.6 JP1.10 | 55.68,50.04 JP1.8 | v18.03,68.66 26.77,68.66 28.25,67.11 C24.1 | 25.91,55.57 IC1.6 | IC1.6 | IC1.6 IC1.5 22.7,56.07 v21.77,56.08 | 25.91,55.57 | v30.25,61.57 30.02,61.34 29.75,60.99 IC1.92 | 25.1,8.99 24.71,8.99 24.65,9.05 IC2.7 | 19.09,55.39 19.11,55.39 v19.12,55.4 | v52.4,75.59 52.4,74.22 PAD3.1 | C19.2 33.53,36.07 | 25.6,7.39 26.11,8.13 26.15,8.13 | 25.86,7.26 26.06,7.95 | 23.93,13.61 23.93,14.04 C2.2 | v4.06,55.93 3.66,55.93 3.66,54.92 Q5.2 | C15.2 18.29,57.56 18.14,57.55
  Top 0.305: 25.86,7.26 25.86,6.9 C5.2 | C7.2 39.14,12.53 39.14,8.2 36.76,8.2 C6.C
  Top 0.356: 37.26,57.51 34.34,57.51 | 19.09,55.39 18.22,55.39 | 24.71,8.99
  Top 0.406: C13.2 18.14,57.55 C18.2 C16.2 | 29.46,66.93 C21.2 C12.2 C23.2 R2.2 | C24.1 29.46,66.93 | 27.01,55.57 27,50.57 28.75,46.23 | 37.26,57.51 37.26,54.56 37.19,54.56 37.19,49.55 37.24,46.56 39.89,44.64 C20.2 | C14.2 C25.1 19.05,65.02 18.03,65.02 v18.03,68.66 | C28.2 47.62,78.62 IC5.P$6 IC5.P$1 51.5,78.69 52.43,78.69 | R2.2 37.33,61.37 | 52.43,69.6 52.43,74.17 | v46.23,75.54 v46.23,79.73 46.23,79.76 v52.43,79.76 52.43,78.69 | 52.43,74.17 PAD3.1 | 52.43,74.17 52.43,78.69 | 52.43,69.6 PAD5.1 | 52.43,69.6 52.43,67.14 IC4.3 52.45,67.11 49.78,67.11 49.78,66.69 C1.2 49.66,65.79 v48.34,65.79 | R2.2 v39.37,63.75 | C2.2 24.15,14.1 | IC2.PP 26.15,10.67 | 24.15,10.94 IC2.PP@2 IC2.PP | IC2.PP IC2.PP@1 | S2.1 43.38,25.96 | S4.1 26.95,23.52 30.84,23.52 32.16,22.22 32.16,20.25 | 48.06,54.61 C22.2 47.91,53.85 47.89,53.65 C11.2 | 26.15,7.11 C5.2 | 29.46,66.93 v29.61,66.9 | S3.1 33.93,26.54 | 23.93,13.61 23.93,11.68 | 34.44,4.42 C9.C | C13.2 18.12,64.97 17.87,64.97 | C13.2 18.12,59.99 R19.1
  Top 0.508: C25.1 17.87,64.97 C26.1 | 33.91,28.74 33.91,30.9
  Top 0.61: C10.2 28.5,42.65 | C2.2 R26.1 | IC3.2 56.52,13.97 C8.1 | IC3.4 59.05,18.29 56.49,18.29 56.49,18.2 | 56.49,18.2 56.49,16.2 IC3.2 | 56.49,18.2 IC3.2 | C3.C 29.46,11.43 28.8,11.43 | 33.53,36.07 35.81,36.07 42.16,42.42 40.13,44.45
  Top 0.813: C10.2 C17.2 C19.2 33.53,35.31 33.93,34.9 33.93,30.91 33.91,30.9 | U1.GND1 8.31,2.9 U1.CD2 8.88,6.35 8.88,13.97 | 8.88,13.97 U1.CD1 | 12.43,14.1 U1.6 | 8.88,13.97 12.43,13.97 12.43,14.1 | 12.43,14.1 C2.2 | U1.GND2 22.84,2.03 27.18,2.03 B-.1 29.46,3.44 C5.2 | 56.49,18.2 53.65,18.21 R11.1 v52.31,16.86 | 43.38,25.96 v46.18,23.16 | S2.1 S3.1 34.59,25.43 36.17,23.85 39.04,23.85 39.04,20.29 35.28,20.25 32.16,20.25 32.16,16.51 30.48,16.51 28.8,14.63 28.8,11.43 28.8,11.33 28.14,10.67 26.15,10.67 | 33.93,26.54 33.94,28.77 33.91,28.74 | 32,6.86 34.44,4.42
  Top 1.27: C6.C 32.12,9.78 D2.A 32.12,6.98 32,6.86 B-.1
  Bottom 0.203: LCD1.9 LCD1.8 20.07,71.24 20.02,71.24
  Bottom 0.254: 17.94,71.22 20.02,71.24 20.01,71.67 | 19.1,55.37 19.1,55.39 v19.12,55.4 | v4.06,55.93 17.88,69.75 17.94,69.75
  Bottom 0.356: v30.25,61.57 30.5,63.21 30.5,64.19 29.56,64.19 v29.61,66.9
  Bottom 0.406: v18.03,68.66 17.96,68.58 17.94,69.75 17.94,71.22 | v39.37,63.75 41.91,63.75 44.45,65.79 v48.34,65.79 | JP1.10 JP1.14 JP1.12 JP1.20 | JP1.20 JP1.16 JP1.18 JP1.20 | v46.18,23.16 46.23,23.16 | v21.77,56.08 19.1,55.37 | v21.77,56.08 21.76,56.07 | 21.76,56.07 21.77,56.06 | v21.77,56.08 21.72,56.03 21.76,56.07
  Bottom 0.813: 46.23,23.16 v52.31,16.86
  other vias: 25.15,10.67
  pour Top: 0.64,0.64 0.64,71.3 8.05,71.3 13.06,76.3 37.74,76.3 37.74,80.82 60.6,80.82 60.6,0.64
LCD_BACK  (via drill 0.38)
  Top 0.203: v34.57,45.57 31.14,49 31.14,57.86 32.03,58.75 32.92,58.75 33.22,59.05 33.22,59.31 33.25,59.33 IC1.85 | v38.61,34.16 37.47,34.16 37.16,33.86 v36.04,33.86 | v24.03,32.61 23.19,31.77 22.78,31.77 22.25,32.31 22.25,32.74 18.47,36.53 18.03,36.53 v17.32,37.24 | v3.96,50.67 3.45,51.18 3.45,51.92 R30.1
  Bottom 0.203: v34.57,45.57 35.08,45.06 35.08,43.87 34.87,43.66 34.87,38.76 38.61,35.03 v38.61,34.16 | v36.04,33.86 35.74,34.16 25.58,34.16 v24.03,32.61 | v17.32,37.24 17.32,38.02 16.87,38.48 16.87,39.7 15.29,41.28 15.29,42.14 6.2,51.23 4.52,51.23 v3.96,50.67
LCD_RESET  (via drill 0.38)
  Top 0.203: IC1.86 32.75,61.89 | 32.75,61.89 32.76,61.91 | v35.05,67.82 v35.05,69.34 | v35.06,66.09 35.05,64.88 32.75,61.89
  Bottom 0.203: v35.05,69.34 35.05,70.36 26.42,70.36 26.42,71.75 LCD1.2 | v35.06,66.09 v35.05,67.82
MISO0  (via drill 0.38)
  Top 0.203: v13.82,20.78 11.12,20.78 11.12,18.14 U1.7 | v19.07,44.55 21.34,46.58 23.77,46.58 IC1.24
  Bottom 0.203: v13.82,20.78 15.44,20.78 15.49,20.83 16.76,23.88 19.07,25.65 v19.07,44.55
MOSI0  (via drill 0.38)
  Top 0.203: v20.32,18.75 19.91,19.15 15.85,19.15 15.85,18.14 U1.3 | v22.55,44.55 23.77,45.97 IC1.25
  Bottom 0.203: v20.32,18.75 22.25,20.78 22.25,44.25 v22.55,44.55 23.16,45.36 23.16,51.66 20.73,51.66 18.29,49.02 18.29,43.84 17.07,43.84 14.43,46.58 14.43,60.6 23.52,69.95 23.52,71.25 25.2,71.25 LCD1.3
N$1  (via drill 0.38)
  Top 0.203: v8.64,22.1 2.29,22.1 2.29,21.08 R3.2 | v11.01,31 11.02,30.08 9.65,30.08 9.57,30.04 X1.VBUS
  Bottom 0.203: v8.64,22.1 11.28,24.64 11.27,30.62 v11.01,31
N$2
  Top 0.203: X1.D- 12.45,29.25 C4.2 R5.2
N$3
  Top 0.203: 12.39,27.48 C4.1 10.92,28.45 X1.D+ 2.08,28.45 2.08,35.94 R7.1 3.15,35.94 R6.2 3.07,43.42
N$4
  Top 0.406: R2.1 41.27,66.94 S1.3 S1.4
N$5  (via drill 0.38)
  Top 0.203: v29.52,62.47 29.24,61.84 29.25,61.62 | R5.1 12.39,33.99 11.38,35 4.98,35 5,42.98 v23.06,42.98 | 29.26,60 IC1.93
  Top 0.254: 29.25,61.62 29.26,60
  Bottom 0.203: v23.06,42.98 29.26,49.43 29.27,61.33 29.24,61.62 v29.52,62.47
N$6  (via drill 0.38)
  Top 0.203: 28.75,62.1 28.75,62.94 v32.25,64.76 | v32.24,67.89 32.24,70.22 10.29,70.22 10.26,70.13 10.26,61.47 9.78,60.99 8.53,60.99 5.46,57.91 5.46,51.05 5.71,50.8 5.71,50.19 4.09,48.57 3.17,48.57 3.1,48.51 R6.1
  Top 0.254: 28.75,62.1 IC1.94
  Bottom 0.203: v32.24,67.89 v32.25,64.76
N$7
  Top 0.203: R7.2 5.73,40.19
  Top 0.406: 5.73,40.19 Q1.2
N$8  (via drill 0.38)
  Top 0.203: 7.84,40.2 D1.2 11.79,40.28 11.99,39.98 v23.06,39.98 | v47.95,50.09 47.95,48.62 R9.1 | 47.95,56.82 47.95,57.76 R8.1 | 47.95,56.82 v47.95,56.54 | v42.14,67.11 42.14,57.94 44.7,57.94 45.52,56.82 47.95,56.82
  Top 0.406: Q1.1 7.84,40.2
  Bottom 0.203: v47.95,56.54 v47.95,50.09 | v23.06,39.98 31.09,48.21 31.09,62.84 32.05,63.7 35.74,65.38 37.9,67.11 v42.14,67.11
N$9  (via drill 0.38)
  Top 0.254: 25.65,8.76 IC2.9
  Top 0.279: v25.04,8.05 25.3,8.18 arc62 25.65,8.76
  Top 1.27: v37.59,9.91 37.59,13.23 L1.2
  Bottom 0.813: v25.04,8.05 27.05,8.05 29.11,9.91
  Bottom 1.27: 29.11,9.91 v37.59,9.91
N$11  (via drill 0.38)
  Top 0.203: D4.1 49.9,27.71 R21.2 49.99,27.47 v49.99,26.21 | R20.1 36.69,28.04 v42.82,28.04
  Bottom 0.203: v49.99,26.21 47.73,26.21 46.95,25.44 | 46.95,25.44 S2.3 | v42.82,28.04 44.35,28.04 46.95,25.44
N$12
  Top 0.61: IC3.5 59.05,19.7 R11.2 R10.1
N$13
  Top 0.813: D3.A 51.37,15.69 54.86,15.68 IC3.1
  Top 1.27: D3.A 45.1,9.93 L2.2
N$14
  Top 0.61: IC3.8 53.72,23.46 R12.1
N$15  (via drill 0.38)
  Top 0.61: R13.2 R12.2
  Top 0.813: L2.1 52.96,6.39 | 56.39,24.64 R13.2 | IC3.7 arc-90 56.39,21.52 v56.39,23.22
  Top 1.27: 52.96,6.39 v52.98,12.6 | v56.39,23.22 56.39,24.64
  Bottom 1.27: v52.98,12.6 56.39,16 v56.39,23.22
N$16  (via drill 0.38)
  Top 0.203: C26.2 Q2.1 v16.31,60.2 | v26.97,58.03 27.25,58.52 IC1.97
  Bottom 0.203: v16.31,60.2 16.31,54.36 26.11,54.36 26.11,57.15 v26.97,58.03
N$17  (via drill 0.38)
  Top 0.203: C27.1 Q2.2 v17.2,51.69 | v26.95,56.79 26.21,57.35 26.09,57.48 26.09,58.5 26.77,58.88 IC1.98
  Bottom 0.203: v17.2,51.69 20.09,51.71 20.5,52.12 26.95,52.15 v26.95,56.79
N$18
  Top 0.406: C25.2 19.25,67.82 25.65,67.82 R14.1
N$19  (via drill 0.38)
  Top 0.203: R17.1 47.95,43.13 51.82,46.99 51.82,50.04 JP1.7 | v36.79,63.47 36.78,62.43 36.78,60 IC1.78
  Bottom 0.203: v36.79,63.47 40.79,66.24 42.62,66.24 42.93,66.55 52.83,66.5 52.83,59.26 51.74,58.22 51.74,57.18 52.55,56.39 54.36,56.39 54.36,51.05 53.24,50.04 JP1.7
N$20
  Top 0.203: IC1.76 37.8,59.79 39.01,58.57 40.64,58.57 41.86,57.35 44.25,57.35 45.9,55.75 51.89,55.75 52.48,56.39 56.19,56.39 57,55.55 57,46.23 52.53,46.23 51.71,45.42 51.71,42.55 53.03,42.52 JP1.13
N$21  (via drill 0.38)
  Top 0.203: R18.1 55.27,27.69 55.27,33.53 55.07,33.53 54.36,34.27 54.36,44.96 JP1.11 | v36.27,58.32 36.27,59.79 IC1.79
  Bottom 0.203: v36.27,58.32 35.51,57.71 35.51,43.89 43.56,34.84 44.03,34.17 44.24,33.9 51.82,33.91 51.82,43.74 53.03,44.96 | 53.03,44.96 53.03,47.4 JP1.9 | 53.03,44.96 JP1.11
N$22
  Top 0.203: 40.28,46.07 IC1.51 40.23,45.97 42.47,43.74 | 42.47,43.74 45.92,40.28 R16.1 | 42.47,43.74 45.52,46.81 46.89,46.81 46.89,44.88 48.62,44.88 49.99,46.3 49.99,49.43 53.03,52.48 JP1.5
N$23  (via drill 0.38)
  Top 0.203: v49.25,47.75 49.25,47.27 47.95,45.97 R15.1
  Bottom 0.203: v49.25,47.75 49.25,48.69 51.82,51.26 51.82,53.9 53.03,55.12 JP1.3
N$24
  Top 0.61: C8.2 57.78,14.23 IC3.3
N$25
  Top 0.203: R20.2 38.49,30.19 D5.3
N$26
  Top 0.254: R27.1 51.83,24.04 Q3.1
N$27
  Top 0.203: D4.3 47.32,27.35 R27.2
N$28
  Top 0.203: S3.3 31.25,24.35 R23.2 R22.1
N$29
  Top 0.203: R14.2 26.25,64.52 IC1.99
  Top 0.406: R14.2 C24.2
N$30
  Top 0.203: S4.3 22.55,23.39 22.55,27.48 23.89,28.82 R25.2 R24.1
N$31
  Top 0.203: 25.63,12.67 25.65,12.67
  Top 0.254: 25.39,13.49 25.63,12.67
  Top 0.305: 25.65,12.67 25.91,13.5
N$32  (via drill 0.6)
  Top 0.254: v44.23,48.12 43.54,48.36 41.43,48.36 41.22,48.57 39.93,48.57
N$33  (via drill 0.6)
  Top 0.254: 40.05,48.07 40.81,48.07 v42.42,46.48
N$34
  Top 0.203: R31.2 21.48,61.85 C29.1 23.3,58.07 IC1.1
N$35
  Top 0.305: R28.2 6.82,52.12 Q4.1
N$36
  Top 0.305: R29.2 4.34,59.39 Q6.1
N$37
  Top 0.305: Q5.3 1.82,57.65 R29.1
N$38
  Top 0.305: Q5.1 R30.2
NRST  (via drill 0.38)
  Top 0.203: v41.4,49.35 40.77,49.07 | 39.85,49.07 IC1.57 | v25.22,40.84 14.66,40.84 14.02,41.3 D1.3 | v36.85,34.6 37.31,34.9 v44.73,34.9 48.18,34.9 53.03,39.88 JP1.15 | v47.14,62.23 45.09,62.23 45.09,62.18
  Top 0.254: 40.77,49.07 39.85,49.07
  Top 0.406: IC4.1 49.66,65.04 C1.1 47.37,64.89 | S1.1 47.37,64.89 | S1.2 45.09,62.18 S1.1 | S1.1 47.64,66.29 R1.1 | 47.37,64.89 47.24,64.89
  Bottom 0.203: v47.14,62.23 47.14,55.12 v41.4,49.35 44.7,46.38 v44.73,34.9 | v25.22,40.84 26.49,36.22 26.49,34.6 v36.85,34.6
ON  (via drill 0.38)
  Top 0.203: v43.99,32.61 46.13,29.72 D4.2 | v35.6,42.64 35.76,43.13 35.76,44.15 IC1.46
  Bottom 0.203: v43.99,32.61 35.66,42.72 v35.6,42.64
PWR_EN  (via drill 0.38)
  Top 0.203: IC2.1 26.15,12.43 v26.82,13.21 | v26.82,16.94 25.69,16.89 R26.2 | v46.06,17.02 Q3.3
  Bottom 0.203: v26.82,13.21 v26.82,16.94 26.8,17.02
  Bottom 0.254: v46.06,17.02 26.9,17.02 v26.82,16.94
SCK0  (via drill 0.38)
  Top 0.203: v11.94,19.8 13.03,19.07 13.21,18.85 13.41,18.14 U1.5 | 17.48,43.74 25.2,43.74 25.6,44.15 IC1.26 | v11.95,43.74 17.48,43.74 | 17.48,43.74 v17.48,44.65
  Bottom 0.203: v11.94,19.8 11.93,19.99 v11.95,43.74 | v17.48,44.65 14.94,47.19 14.94,60.4 24.05,69.65 24.05,70.76 25.27,70.76 LCD1.4
SW_CENTER  (via drill 0.38)
  Top 0.203: v21.01,37.97 29.26,29.92 R23.1 | v21.13,50.9 22.55,52.07 IC1.13
  Bottom 0.203: v21.01,37.97 21.13,38.27 v21.13,50.9
SW_LEFT  (via drill 0.38)
  Top 0.203: v46.14,31.05 48.75,31.03 51.61,27.69 R21.1 | v30.28,45.57 30.28,59.79 IC1.91
  Bottom 0.203: v46.14,31.05 37.86,31 37.87,35.15 33.73,39.22 | 33.73,39.22 31.7,39.22 | v30.28,45.57 30.28,42.72 33.73,39.27 33.73,39.22
SW_RIGHT  (via drill 0.38)
  Top 0.203: v20.83,30.12 21.74,30.12 21.95,29.92 R25.1 | v22.35,50.93 22.86,51.57 | 23.75,51.57 IC1.14
  Top 0.254: 22.86,51.57 23.75,51.57
  Bottom 0.203: v20.83,30.12 21.74,31.04 21.74,50.24 v22.35,50.93
USB_PR  (via drill 0.38)
  Top 0.203: R3.1 R4.2 5.79,19.81 v6.81,18.49 | v43.66,50.57 39.83,50.57 IC1.60
  Bottom 0.203: v43.66,50.57 47.55,46.79 51.77,46.76 51.74,48.03 52.55,48.77 54.35,48.76 54.35,34.18 48.77,28.82 22.76,28.82 22.76,20.37 21.13,18.54 20.12,17.25 7.72,17.25 v6.81,18.49
USB_PUP
  Top 0.203: R9.2 42.19,50.09 IC1.59
VLED  (via drill 0.38)
  Top 0.406: 8.13,64.47 Q6.3 8.33,64.41 v9.12,64.41
  Bottom 0.203: 19.43,72.31 19.43,72.44 19.94,72.44 LCD1.10 20.14,72.26
  Bottom 0.305: 20.12,72.31 20.14,72.29 20.14,72.26 20.09,72.31
  Bottom 0.406: 19.43,72.31 18.16,72.31 17.27,71.5 17.27,69.93 11.76,64.41 v9.12,64.41
VLED_SUPPLY  (via drill 0.38)
  Top 0.406: 46.11,14.86 D3.C 46.06,15.29 C7.1 43.69,15.47 v43.69,17.78 | v4.72,57.94 8.31,61.52 8.91,61.52 8.91,62.05 Q6.2 | v50.06,17.7 50.39,17.7 50.6,17.91 R10.2
  Top 0.61: C6.A 41.07,9.15
  Top 0.813: C6.A 46.11,14.37 D3.C
  Bottom 0.406: v4.72,57.94 1.22,54.43 1.22,22.91 7.44,16.69 20.34,16.69 21.44,17.78 27.15,17.78 27.36,17.58 43.48,17.58 v43.69,17.78 43.87,17.86 46.41,17.86 46.56,17.7 v50.06,17.7
VSENSE  (via drill 0.38)
  Top 0.203: IC5.P$3 51.45,75.44 50.34,75.44 50.37,75.41 PAD1.1 | v24.23,63.58 20.68,63.58 20.68,59.97 R19.2 19.94,59.89 19.94,59.28 20.19,59.03 21.87,59.03 22.23,58.67 22.23,57.43 22.53,57.12 22.96,57.12 22.99,57.1 23.19,57.1 IC1.3
  Top 0.254: 23.29,57.07 23.3,57.07 IC1.3
  Bottom 0.203: PAD1.1 50.37,68.27 47.3,68.27 46.99,68.58 33.78,68.58 33.27,69.09 PAD6.1 24.38,64.49 24.36,64.49 24.26,64.39 24.26,64.36 v24.23,63.58
(copper drawn outside any net)
  shapes: Bottom area x1

### Text on the board
Top: TOP
Bottom: BOT
tPlace: Light Meter rev B | John Zehetner
tNames: GND | 3.3V | 3.3V | Iout | Iout | GND | PA24 | PA23